# EAGLE schematic Motor_Lab_v8 (EAGLE 8.7.0)
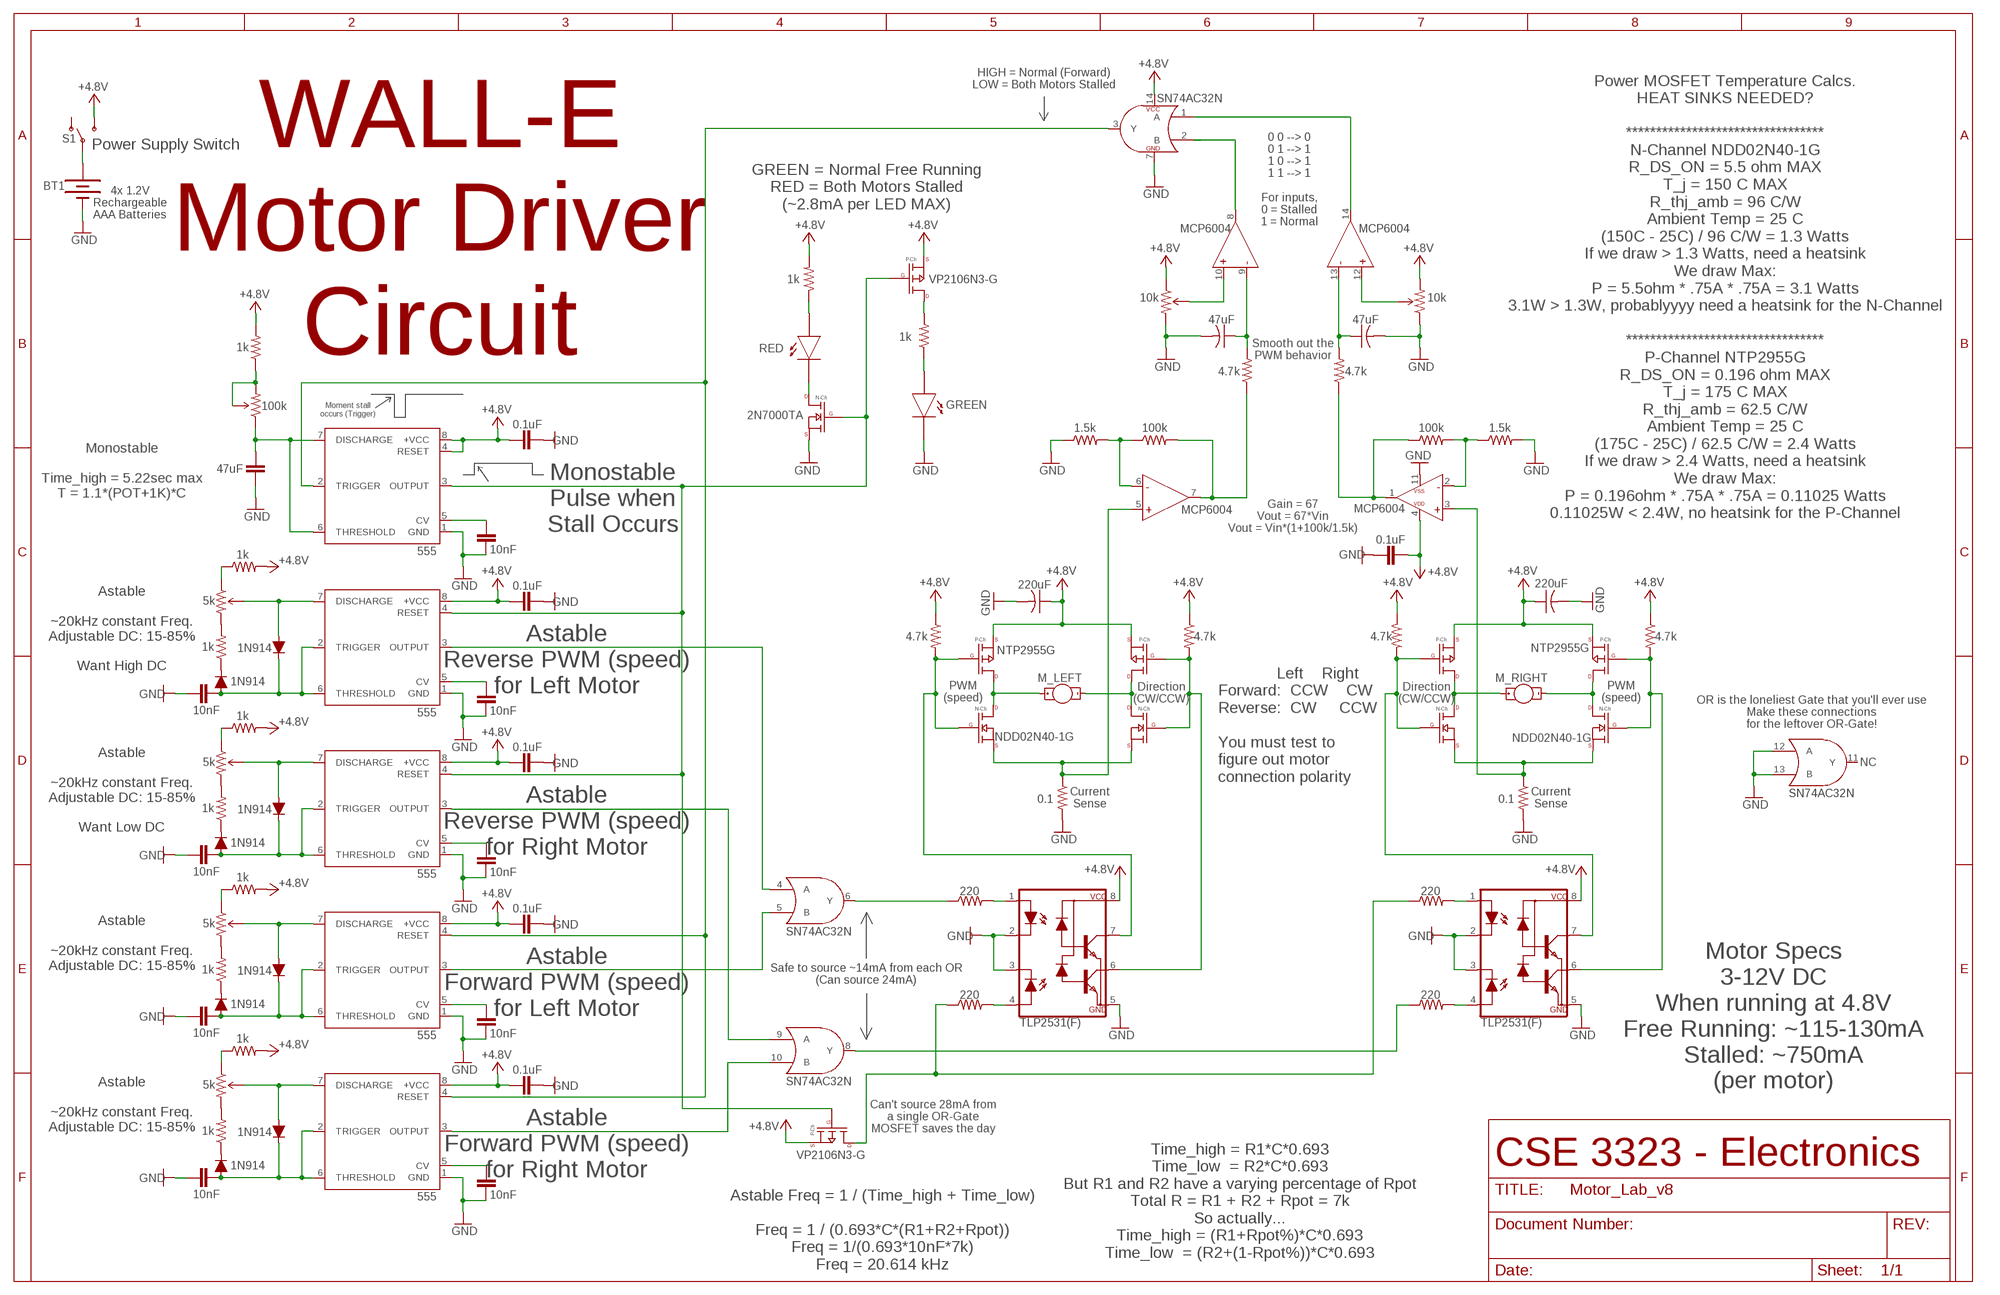
[diagram p0: schematic, sheet 1]

## Parts
BT1  BATTERY-AAA  [BATTERY-AAA]
C1  220uF  C-US025-024X044  [C025-024X044]
C2  220uF  C-US025-024X044  [C025-024X044]
C3  0.1uF  0.1UF-KIT-EZ-50V-20%  [CAP-PTH-SMALL-KIT]
C5  0.1uF  0.1UF-KIT-EZ-50V-20%  [CAP-PTH-SMALL-KIT]
C6  10nF  0.1UF-KIT-EZ-50V-20%  [CAP-PTH-SMALL-KIT]
C7  10nF  0.1UF-KIT-EZ-50V-20%  [CAP-PTH-SMALL-KIT]
C8  0.1uF  0.1UF-KIT-EZ-50V-20%  [CAP-PTH-SMALL-KIT]
C9  10nF  0.1UF-KIT-EZ-50V-20%  [CAP-PTH-SMALL-KIT]
C10  0.1uF  0.1UF-KIT-EZ-50V-20%  [CAP-PTH-SMALL-KIT]
C11  10nF  0.1UF-KIT-EZ-50V-20%  [CAP-PTH-SMALL-KIT]
C12  0.1uF  0.1UF-KIT-EZ-50V-20%  [CAP-PTH-SMALL-KIT]
C13  10nF  0.1UF-KIT-EZ-50V-20%  [CAP-PTH-SMALL-KIT]
C14  0.1uF  0.1UF-KIT-EZ-50V-20%  [CAP-PTH-SMALL-KIT]
C15  10nF  0.1UF-KIT-EZ-50V-20%  [CAP-PTH-SMALL-KIT]
C16  10nF  0.1UF-KIT-EZ-50V-20%  [CAP-PTH-SMALL-KIT]
C17  10nF  0.1UF-KIT-EZ-50V-20%  [CAP-PTH-SMALL-KIT]
C18  10nF  0.1UF-KIT-EZ-50V-20%  [CAP-PTH-SMALL-KIT]
C19  47uF  0.1UF-KIT-EZ-50V-20%  [CAP-PTH-SMALL-KIT]
C20  47uF  C-US025-024X044  [C025-024X044]
C22  47uF  C-US025-024X044  [C025-024X044]
D1  RED  LED_5MM  [LED5MM]
D2  GREEN  LED_5MM  [LED5MM]
D3  1N914  DIODE-1N4148  [DIODE-1N4148]
D4  1N914  DIODE-1N4148  [DIODE-1N4148]
D5  1N914  DIODE-1N4148  [DIODE-1N4148]
D6  1N914  DIODE-1N4148  [DIODE-1N4148]
D7  1N914  DIODE-1N4148  [DIODE-1N4148]
D8  1N914  DIODE-1N4148  [DIODE-1N4148]
D9  1N914  DIODE-1N4148  [DIODE-1N4148]
D10  1N914  DIODE-1N4148  [DIODE-1N4148]
IC1  555  555-TIMERP  [DIP08]
IC2  555  555-TIMERP  [DIP08]
IC3  555  555-TIMERP  [DIP08]
IC4  555  555-TIMERP  [DIP08]
IC5  555  555-TIMERP  [DIP08]
M_LEFT  MOTOR10MM  [VIBE-MOTOR-10MM]
M_RIGHT  MOTOR10MM  [VIBE-MOTOR-10MM]
POT1  5k  TRIMPOT  [TRIM_POT_PTH]
POT4  5k  TRIMPOT  [TRIM_POT_PTH]
POT5  5k  TRIMPOT  [TRIM_POT_PTH]
POT6  5k  TRIMPOT  [TRIM_POT_PTH]
POT7  100k  TRIMPOT  [TRIM_POT_PTH]
POT8  10k  TRIMPOT  [TRIM_POT_PTH]
POT9  10k  TRIMPOT  [TRIM_POT_PTH]
R1  0.1  R-US_0204/2V  [0204V]
R2  0.1  R-US_0204/2V  [0204V]
R3  100k  R-US_0204/2V  [0204V]
R4  100k  R-US_0204/2V  [0204V]
R5  1.5k  R-US_0204/2V  [0204V]
R6  1.5k  R-US_0204/2V  [0204V]
R7  1k  R-US_0204/2V  [0204V]
R8  1k  R-US_0204/2V  [0204V]
R9  1k  R-US_0204/2V  [0204V]
R10  1k  R-US_0204/2V  [0204V]
R11  1k  R-US_0204/2V  [0204V]
R12  1k  R-US_0204/2V  [0204V]
R13  1k  R-US_0204/2V  [0204V]
R14  1k  R-US_0204/2V  [0204V]
R15  1k  R-US_0204/2V  [0204V]
R16  1k  R-US_0204/2V  [0204V]
R19  4.7k  R-US_0204/2V  [0204V]
R20  220  R-US_0204/2V  [0204V]
R21  4.7k  R-US_0204/2V  [0204V]
R22  4.7k  R-US_0204/2V  [0204V]
R23  4.7k  R-US_0204/2V  [0204V]
R24  4.7k  R-US_0204/2V  [0204V]
R25  4.7k  R-US_0204/2V  [0204V]
R26  220  R-US_0204/2V  [0204V]
R27  1k  R-US_0204/2V  [0204V]
R28  220  R-US_0204/2V  [0204V]
R29  220  R-US_0204/2V  [0204V]
S1  SWITCH-SPDT-PTH-11.6X4.0MM  [SWITCH_SPDT_PTH_11.6X4.0MM]
U$1  STP3NK50Z  MOSFET-N  [TO92-]
U$2  NDD02N40-1G  MOSFET-N  [TO92-]
U$3  NDD02N40-1G  MOSFET-N  [TO92-]
U$4  STP3NK50Z  MOSFET-N  [TO92-]
U$5  NTP2955G  MOSFET-P  [TO92-]
U$6  NTP2955G  MOSFET-P  [TO92-]
U$7  NTP2955G  MOSFET-P  [TO92-]
U$8  NTP2955G  MOSFET-P  [TO92-]
U$9  2N7000TA  MOSFET-N  [TO92-]
U$10  VP2106N3-G  MOSFET-P  [TO92-]
U$11  SN74AC32N  [DIP14]
U$12  VP2106N3-G  MOSFET-P  [TO92-]
U$13  TLP2531(F)  [DIP08]
U$14  TLP2531(F)  [DIP08]
U$15  MCP6004  [DIP14]

## Nets
GND: BT1.GND@1(-) C1.2 C2.2 C3.1 C5.2 C6.1 C7.1 C8.2 C9.1 C10.2 C11.1 C12.2 C13.1 C14.2 C15.1 C16.1 C17.1 C18.1 C19.1 C20.2 C22.2 D2.K IC1.1(GND) IC2.1(GND) IC3.1(GND) IC4.1(GND) IC5.1(GND) POT8.3(CW) POT9.1(CCW) R1.2 R2.2 R5.1 R6.2 U$9.1(SOURCE) U$11.7(GND) U$11.12(A) U$11.13(B) U$13.2(C1) U$13.3(C2) U$13.5(GND) U$14.2(C1) U$14.3(C2) U$14.5(GND) U$15.11(VSS)
N$1: BT1.PWR@1(+) S1.2(P)
N$2: M_LEFT.+ U$1.3(DRAIN) U$5.1(DRAIN)
N$3: M_RIGHT.- U$4.3(DRAIN) U$8.1(DRAIN)
N$4: R29.1 U$11.8(Y)
N$5: IC1.3(OUTPUT) U$11.10(B)
N$6: M_RIGHT.+ U$3.3(DRAIN) U$7.1(DRAIN)
N$7: IC3.4(RESET) IC4.4(RESET) IC5.3(OUTPUT) U$9.2(GATE) U$10.2(GATE) U$12.2(GATE)
N$8: R2.1 U$3.1(SOURCE) U$4.1(SOURCE) U$15.3(IN+)
N$9: R19.2 U$1.2(GATE) U$5.2(GATE) U$13.7(VO1)
N$10: D1.A R7.1
N$11: D1.K U$9.3(DRAIN)
N$12: IC2.3(OUTPUT) U$11.5(B)
N$13: R20.1 U$11.6(Y)
N$14: R3.2 R22.1 U$15.7(OUT)
N$15: R1.1 U$1.1(SOURCE) U$2.1(SOURCE) U$15.5(IN+)
N$16: R4.1 R24.1 U$15.1(OUT)
N$17: R3.1 R5.2 U$15.6(IN-)
N$20: POT8.2(WIPER) U$15.10(IN+)
N$21: POT9.2(WIPER) U$15.12(IN+)
N$22: M_LEFT.- U$2.3(DRAIN) U$6.1(DRAIN)
N$23: U$11.2(B) U$15.8(OUT)
N$24: U$11.1(A) U$15.14(OUT)
N$25: R8.2 U$10.1(DRAIN)
N$26: D2.A R8.1
N$27: IC3.3(OUTPUT) U$11.9(A)
N$28: IC4.3(OUTPUT) U$11.4(A)
N$29: C7.2 IC2.5(CV)
N$30: C9.2 IC3.5(CV)
N$31: C6.2 IC1.5(CV)
N$32: C11.2 IC4.5(CV)
N$33: C13.2 IC5.5(CV)
N$34: POT1.3(CW) R10.2
N$35: POT1.1(CCW) R9.1
N$36: D3.C R10.1
N$37: POT4.3(CW) R12.2
N$38: D4.A IC1.7(DISCHARGE) POT1.2(WIPER)
N$39: C15.2 D3.A D4.C IC1.2(TRIGGER) IC1.6(THRESHOLD)
N$40: POT4.1(CCW) R11.1
N$41: D5.C R12.1
N$42: D6.A IC2.7(DISCHARGE) POT4.2(WIPER)
N$43: C16.2 D5.A D6.C IC2.2(TRIGGER) IC2.6(THRESHOLD)
N$44: POT5.3(CW) R14.2
N$45: POT5.1(CCW) R13.1
N$46: D7.C R14.1
N$47: D8.A IC3.7(DISCHARGE) POT5.2(WIPER)
N$48: C17.2 D7.A D8.C IC3.2(TRIGGER) IC3.6(THRESHOLD)
N$49: POT6.3(CW) R16.2
N$50: POT6.1(CCW) R15.1
N$51: D9.C R16.1
N$52: D10.A IC4.7(DISCHARGE) POT6.2(WIPER)
N$53: C18.2 D9.A D10.C IC4.2(TRIGGER) IC4.6(THRESHOLD)
N$54: C19.2 IC5.6(THRESHOLD) IC5.7(DISCHARGE) POT7.1(CCW)
N$55: R4.2 R6.1 U$15.2(IN-)
N$56: IC1.4(RESET) IC2.4(RESET) IC5.2(TRIGGER) U$11.3(Y)
N$58: R20.2 U$13.1(A1)
N$59: R28.2 U$13.4(A2)
N$60: C22.1 R22.2 U$15.9(IN-)
N$61: C20.1 R24.2 U$15.13(IN-)
N$62: R25.2 U$2.2(GATE) U$6.2(GATE) U$13.6(VO2)
N$63: R23.2 U$4.2(GATE) U$8.2(GATE) U$14.6(VO2)
N$64: R21.2 U$3.2(GATE) U$7.2(GATE) U$14.7(VO1)
N$65: POT7.2(WIPER) POT7.3(CW) R27.1
N$67: R26.1 R28.1 U$12.1(DRAIN)
N$68: R26.2 U$14.1(A1)
N$70: R29.2 U$14.4(A2)
VCC: C1.1 C2.1 C3.2 C5.1 C8.1 C10.1 C12.1 C14.1 IC1.8(+VCC) IC2.8(+VCC) IC3.8(+VCC) IC4.8(+VCC) IC5.4(RESET) IC5.8(+VCC) POT8.1(CCW) POT9.3(CW) R7.2 R9.2 R11.2 R13.2 R15.2 R19.1 R21.1 R23.1 R25.1 R27.2 S1.3(S) U$5.3(SOURCE) U$6.3(SOURCE) U$7.3(SOURCE) U$8.3(SOURCE) U$10.3(SOURCE) U$11.14(VCC) U$12.3(SOURCE) U$13.8(VCC) U$14.8(VCC) U$15.4(VDD) ; supply symbol labelled +4.8V
Unconnected: S1.1(O) U$11.11(Y)

## Notes on the sheet
- HIGH = Normal (Forward)
  LOW = Both Motors Stalled
- Power Supply Switch
- GREEN = Normal Free Running
  RED = Both Motors Stalled
  (~2.8mA per LED MAX)
- 4x 1.2V
  Rechargeable
  AAA Batteries
- 0 0 --> 0
  0 1 --> 1
  1 0 --> 1
  1 1 --> 1
  
  For inputs,
  0 = Stalled
  1 = Normal
- WALL-E
  Motor Driver
  Circuit
- Smooth out the
  PWM behavior
- Moment stall
  occurs (Trigger)
- Monostable
  
  Time_high = 5.22sec max
  T = 1.1*(POT+1K)*C
- Power MOSFET Temperature Calcs.
  HEAT SINKS NEEDED?
  
  *********************************
  N-Channel NDD02N40-1G
  R_DS_ON = 5.5 ohm MAX
  T_j = 150 C MAX
  R_thj_amb = 96 C/W
  Ambient Temp = 25 C
  (150C - 25C) / 96 C/W = 1.3 Watts
  If we draw > 1.3 Watts, need a heatsink
  We draw Max:
  P = 5.5ohm * .75A * .75A = 3.1 Watts
  3.1W > 1.3W, probablyyyy need a heatsink for the N-Channel
  
  *********************************
  P-Channel NTP2955G
  R_DS_ON = 0.196 ohm MAX
  T_j = 175 C MAX
  R_thj_amb = 62.5 C/W
  Ambient Temp = 25 C
  (175C - 25C) / 62.5 C/W = 2.4 Watts
  If we draw > 2.4 Watts, need a heatsink
  We draw Max:
  P = 0.196ohm * .75A * .75A = 0.11025 Watts
  0.11025W < 2.4W, no heatsink for the P-Channel
- Monostable
  Pulse when
  Stall Occurs
- Gain = 67
  Vout = 67*Vin
  Vout = Vin*(1+100k/1.5k)
- Astable
  
  ~20kHz constant Freq.
  Adjustable DC: 15-85%
  
  Want High DC
- Astable
  Reverse PWM (speed)
  for Left Motor
- PWM
  (speed)
- PWM
  (speed)
- Direction
  (CW/CCW)
- Direction
  (CW/CCW)
- OR is the loneliest Gate that you'll ever use
  Make these connections
  for the leftover OR-Gate!
- NC
- Left    Right
  Forward:  CCW    CW
  Reverse:  CW     CCW
  
  You must test to
  figure out motor
  connection polarity
- Current
  Sense
- Current
  Sense
- Astable
  
  ~20kHz constant Freq.
  Adjustable DC: 15-85%
  
  Want Low DC
- Astable
  Reverse PWM (speed)
  for Right Motor
- Astable
  
  ~20kHz constant Freq.
  Adjustable DC: 15-85%
- Safe to source ~14mA from each OR
  (Can source 24mA)
- Astable
  Forward PWM (speed)
  for Left Motor
- Motor Specs
  3-12V DC
  When running at 4.8V
  Free Running: ~115-130mA
  Stalled: ~750mA
  (per motor)
- Astable
  
  ~20kHz constant Freq.
  Adjustable DC: 15-85%
- Can't source 28mA from
  a single OR-Gate
  MOSFET saves the day
- CSE 3323 - Electronics
- Astable
  Forward PWM (speed)
  for Right Motor
- Time_high = R1*C*0.693
  Time_low  = R2*C*0.693
  But R1 and R2 have a varying percentage of Rpot
  Total R = R1 + R2 + Rpot = 7k
  So actually...
  Time_high = (R1+Rpot%)*C*0.693
  Time_low  = (R2+(1-Rpot%))*C*0.693
- Astable Freq = 1 / (Time_high + Time_low)
  
  Freq = 1 / (0.693*C*(R1+R2+Rpot))
  Freq = 1/(0.693*10nF*7k)
  Freq = 20.614 kHz

## Library data of the parts
BT1 = SparkFun-Batteries:BATTERY: Battery - Single Cell A variety of battery chemistries, sizes, and footprints. Device List: 20MM_PTH - Coin Cell Battery Holder - 20mm (PTH) <https://www.sparkfun.com/products/783> 6.8MM_PTH - Coin Cell Battery Holder - 6.8MM(SMD) <https://www.digikey.com/product-detail/en/seiko-instruments/MS621FE-FL11E/728-1057-ND/1889208?WT.srch=1&gclid=CNOQ5a6LzdQCFZS2wAodXCkE0g> 12MM_SMD - Coin Cell Battery Holder - 12mm (SMD) <https://www.sparkfun.com/products/10592> 12MM_PTH - Coin Cell Battery Holder - 12mm (PTH) <https://www.sparkfun.com/products/7948> 20MM_SMD - 20mm Coin Cell Battery Holder (SMD) (2 legs) Used on the Big Time Watch Kit <https://www.sparkfun.com/products/11734> 20MM_SMD_4LEGS - Coin Cell Battery Holder - 20mm (SMD) <https://www.sparkfun.com/products/11892> 20MM_SMD_4LEGS_OVERPASTE - Coin Cell Battery Holder - 20mm (SMD) <https://www.sparkfun.com/products/11892> (Over-paste on the legs) 24.5MM_PTH - Coin Cell Battery Holder - 24.5mm (PTH) <https://www.sparkfun.com/products/8863> 9V - 9V Battery Holder - PC Mount Used on the SparkFun SparkPunk Sound Kit <https://www.sparkfun.com/products/11177> and SparkFun SparkPunk Sequencer Kit <https://www.sparkfun.com/products/12707> 18650 - Battery Holder - 18650 (PTH) <https://www.sparkfun.com/products/13113> AA - Battery Holder - 1xAA (PTH) <https://www.sparkfun.com/products/7949> AAA - Battery Holder - 1xAAA (PTH) <https://www.sparkfun.com/products/12718> AA_KIT - Battery Holder - 1xAA (PTH) <https://www.sparkfun.com/products/7949> Special kit package - pads only have exposed copper on one side of the board. AAA_KIT - Battery Holder - 1xAAA (PTH) <https://www.sparkfun.com/products/12718> Special kit package - pads only have exposed copper on one side of the board.; PROD_ID: BATT-08571; SF_SKU: PRT-12718
C1 C2 C20 C22 = resistor:C-US: CAPACITOR, American symbol
C3 C5 C8 C10 C12 C14 = SparkFun-Capacitors:0.1UF: 0.1µF ceramic capacitors A capacitor is a passive two-terminal electrical component used to store electrical energy temporarily in an electric field.; PROD_ID: CAP-08370
C6 C7 C9 C11 C13 C15-C19 = SparkFun-Capacitors:0.1UF: 0.1µF ceramic capacitors A capacitor is a passive two-terminal electrical component used to store electrical energy temporarily in an electric field.; PROD_ID: CAP-08370; VALUE: 0.1uF
D1 D2 = Brent2:LED_5MM
D3-D10 = SparkFun-DiscreteSemi:DIODE: Diode These are standard reverse protection diodes and small signal diodes. SparkFun Products: SparkFun SparkPunk Sound Kit <https://www.sparkfun.com/products/11177> SparkFun ESP8266 Thing <https://www.sparkfun.com/products/13231>; PROD_ID: DIO-08378; VALUE: 200mA/100V/1V
IC1-IC5 = Brent:555-TIMER: General purpose bipolar Timer Datasheet <http://www.sparkfun.com/datasheets/Components/General/ne555.pdf> SparkFun Products SparkFun SparkPunk Sequencer Kit <https://www.sparkfun.com/products/12707> (KIT-12707) Storefront Component: 555 Timer <https://www.sparkfun.com/products/9273> (COM-09273) Two parts valid for production: VFP: IC-11930 (M7555 PTH) VFP: IC-09173 (555 PTH) - Preferred; PROD_ID: IC-09173; PROD_ID_ALT: IC-09173
M_LEFT M_RIGHT = SparkFun-Electromechanical:MOTOR: Motor (Single-Phase) Two-terminal, single-phase motors. SparkFun Products Vibration Motor <https://www.sparkfun.com/products/8449> (ROB-08449) Physical dimension and wire connections for this powerful vibration motor. Motor has a self adhesive backing.; PROD_ID: COMP-08572; SF_SKU: ROB-08449
POT1 POT4-POT9 = Brent:TRIMPOT
R1-R16 R19-R29 = rcl:R-US_: RESISTOR, American symbol; SPICEPREFIX: R
S1 = SparkFun-Switches:SWITCH-SPDT: Single Pole, Double Throw (SPDT) Switch Single-pole, double-throw (SPDT) switch. Variant Overview SMD-AYZ0202 Surface Mount DPDT Switch <https://www.sparkfun.com/products/597> (COM-00597) Used on e.g. LilyPad Arduino USB - ATmega32U4 Board <https://www.sparkfun.com/products/12049> PTH-11.6X4.0MM SPDT Mini Power Switch <https://www.sparkfun.com/products/102> (COM-00102) Used on e.g. SparkFun Simon Says - Through-Hole Soldering Kit <https://www.sparkfun.com/products/10547> (KIT-10547) PTH-11.6X4.0MM-KIT KIT version of SPDT Mini Power Switch - Simplifies soldering by removing tStop of switch pins - only one side can be soldered. PTH-11.6X4.0MM-LOCK LOCK version of SPDT Mini Power Switch - Offset pins hold switch in place for easier soldering. SMD-RIGHT-ANGLE Surface Mount Right Angle Switch <https://www.sparkfun.com/products/10860> (COM-10860) Used on e.g. SparkFun ESP8266 Thing <https://www.sparkfun.com/products/13231>; PROD_ID: SWCH-08261; SF_SKU: COM-00102
U$1-U$4 U$9 = Brent:MOSFET-N
U$5-U$8 U$10 U$12 = Brent:MOSFET-P
U$11 = Brent:SN74AC32N
U$13 U$14 = Brent:TLP2531(F)
U$15 = Brent:MCP6004